# Altium schematic sheet OTHER.SchDoc
size A4
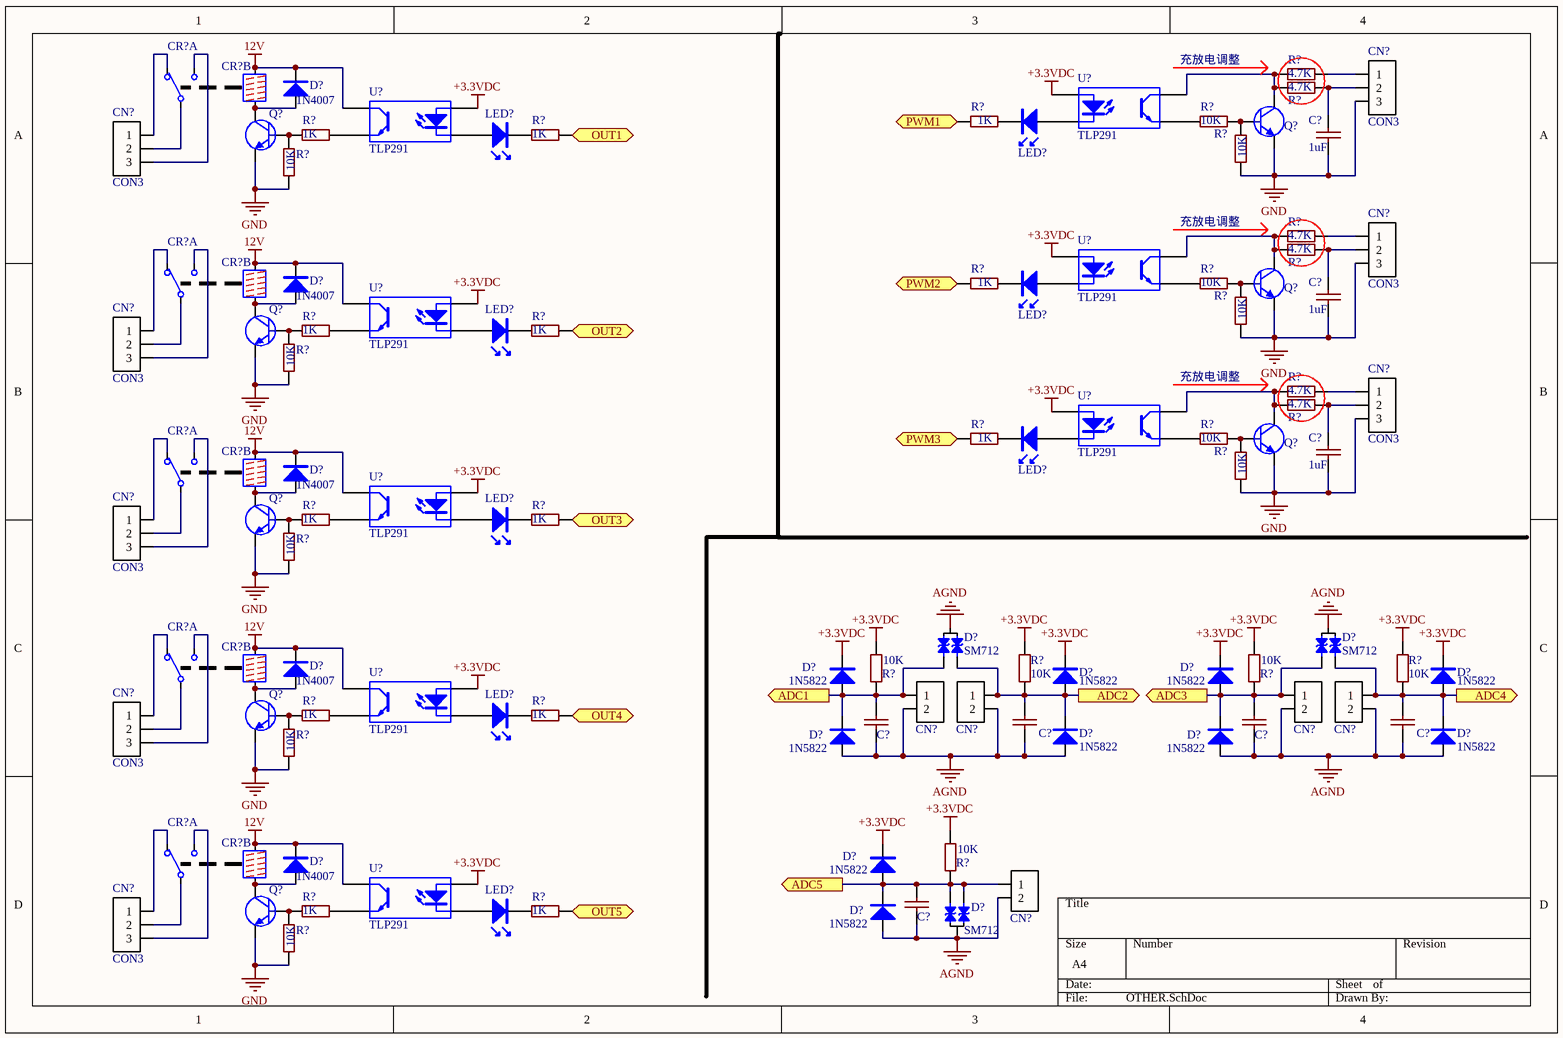
[diagram p0: OTHER.SchDoc]

## Parts
(Parts that share a designator on the sheet are numbered #1, #2 ... from top to bottom, then left to right.)
C?#1  1uF  [0603_C]
C?#2  1uF  [0603_C]
C?#3  1uF  [0603_C]
C?#4  CAP  [0603_C]  (value not drawn)
C?#5  CAP  [0603_C]  (value not drawn)
C?#6  CAP  [0603_C]  (value not drawn)
C?#7  CAP  [0603_C]  (value not drawn)
C?#8  CAP  [0603_C]  (value not drawn)
CN?#1  CON3  [WJ128V-3P]
CN?#2  CON3  [WJ128V-3P]
CN?#3  CON3  [WJ128V-3P]
CN?#4  CON3  [WJ128V-3P]
CN?#5  CON3  [WJ128V-3P]
CN?#6  CON3  [WJ128V-3P]
CN?#7  CON2  [HB9500-2P]  (value not drawn)
CN?#8  CON2  [HB9500-2P]  (value not drawn)
CN?#9  CON2  [HB9500-2P]  (value not drawn)
CN?#10  CON2  [HB9500-2P]  (value not drawn)
CN?#11  CON3  [WJ128V-3P]
CN?#12  CON2  [HB9500-2P]  (value not drawn)
CN?#13  CON3  [WJ128V-3P]
CR?#1  继电器  [G5Q-14]  (value not drawn)  (part A of 2)
CR?#2  继电器  [G5Q-14]  (value not drawn)  (part B of 2)
CR?#3  继电器  [G5Q-14]  (value not drawn)  (part A of 2)
CR?#4  继电器  [G5Q-14]  (value not drawn)  (part B of 2)
CR?#5  继电器  [G5Q-14]  (value not drawn)  (part A of 2)
CR?#6  继电器  [G5Q-14]  (value not drawn)  (part B of 2)
CR?#7  继电器  [G5Q-14]  (value not drawn)  (part A of 2)
CR?#8  继电器  [G5Q-14]  (value not drawn)  (part B of 2)
CR?#9  继电器  [G5Q-14]  (value not drawn)  (part A of 2)
CR?#10  继电器  [G5Q-14]  (value not drawn)  (part B of 2)
D?#1  1N4007  [MUR]
D?#2  1N4007  [MUR]
D?#3  1N4007  [MUR]
D?#4  SM712  [SOT-23]
D?#5  SM712  [SOT-23]
D?#6  1N4007  [MUR]
D?#7  1N5822  [MUR]
D?#8  1N5822  [MUR]
D?#9  1N5822  [MUR]
D?#10  1N5822  [MUR]
D?#11  1N5822  [MUR]
D?#12  1N5822  [MUR]
D?#13  1N5822  [MUR]
D?#14  1N5822  [MUR]
D?#15  1N4007  [MUR]
D?#16  1N5822  [MUR]
D?#17  SM712  [SOT-23]
D?#18  1N5822  [MUR]
LED?#1  Led  [0603_LED]  (value not drawn)
LED?#2  Led  [0603_LED]  (value not drawn)
LED?#3  Led  [0603_LED]  (value not drawn)
LED?#4  Led  [0603_LED]  (value not drawn)
LED?#5  Led  [0603_LED]  (value not drawn)
LED?#6  Led  [0603_LED]  (value not drawn)
LED?#7  Led  [0603_LED]  (value not drawn)
LED?#8  Led  [0603_LED]  (value not drawn)
Q?#1  1318  [SOT-23]  (value not drawn)
Q?#2  9013  [SOT-23]  (value not drawn)
Q?#3  1318  [SOT-23]  (value not drawn)
Q?#4  9013  [SOT-23]  (value not drawn)
Q?#5  1318  [SOT-23]  (value not drawn)
Q?#6  9013  [SOT-23]  (value not drawn)
Q?#7  9013  [SOT-23]  (value not drawn)
Q?#8  9013  [SOT-23]  (value not drawn)
R?#1  4.7K  [0603_R]
R?#2  4.7K  [0603_R]
R?#3  1K  [0603_R]
R?#4  10K  [0603_R]
R?#5  1K  [0603_R]
R?#6  1K  [0603_R]
R?#7  10K  [0603_R]
R?#8  10K  [0603_R]
R?#9  4.7K  [0603_R]
R?#10  4.7K  [0603_R]
R?#11  1K  [0603_R]
R?#12  10K  [0603_R]
R?#13  10K  [0603_R]
R?#14  1K  [0603_R]
R?#15  1K  [0603_R]
R?#16  10K  [0603_R]
R?#17  4.7K  [0603_R]
R?#18  4.7K  [0603_R]
R?#19  1K  [0603_R]
R?#20  10K  [0603_R]
R?#21  10K  [0603_R]
R?#22  1K  [0603_R]
R?#23  1K  [0603_R]
R?#24  10K  [0603_R]
R?#25  10K  [0603_R]
R?#26  10K  [0603_R]
R?#27  10K  [0603_R]
R?#28  10K  [0603_R]
R?#29  1K  [0603_R]
R?#30  1K  [0603_R]
R?#31  10K  [0603_R]
R?#32  10K  [0603_R]
R?#33  1K  [0603_R]
R?#34  1K  [0603_R]
R?#35  10K  [0603_R]
U?#1  TLP291  [sop-4]
U?#2  TLP291  [sop-4]
U?#3  TLP291  [sop-4]
U?#4  TLP291  [sop-4]
U?#5  TLP291  [sop-4]
U?#6  TLP291  [sop-4]
U?#7  TLP291  [sop-4]
U?#8  TLP291  [sop-4]

## Ports
ADC1 (out), ADC2 (out), ADC3 (out), ADC4 (out), ADC5 (out), OUT1 (in), OUT2 (in), OUT3 (in), OUT4 (in), OUT5 (in), PWM1 (in), PWM2 (in), PWM3 (in)

## Nets
12V: CR?#2.5 CR?#4.5 CR?#6.5 CR?#8.5 CR?#10.5 D?#1.K D?#2.K D?#3.K D?#6.K D?#15.K U?#2.4 U?#4.4 U?#6.4 U?#7.4 U?#8.4
+3.3VDC: D?#7.K D?#8.K D?#9.K D?#10.K D?#16.K R?#25.2 R?#26.2 R?#27.2 R?#28.2 R?#32.2 U?#1.1 U?#2.1 U?#3.1 U?#4.1 U?#5.1 U?#6.1 U?#7.1 U?#8.1
AGND: C?#4.2 C?#5.2 C?#6.2 C?#7.2 C?#8.2 CN?#7.2 CN?#8.2 CN?#9.2 CN?#10.2 CN?#12.2 D?#11.A D?#12.A D?#13.A D?#14.A D?#17.3 D?#18.A
GND: C?#1.2 C?#2.2 C?#3.2 CN?#1.3 CN?#3.3 CN?#5.3 Q?#1.2(E) Q?#2.2(E) Q?#3.2(E) Q?#4.2(E) Q?#5.2(E) Q?#6.2(E) Q?#7.2(E) Q?#8.2(E) R?#7.1 R?#8.1 R?#13.1 R?#16.1 R?#21.1 R?#24.1 R?#31.1 R?#35.1
ADC1: C?#4.1 CN?#7.1 D?#4.2 D?#7.A D?#11.K R?#25.1 ; port ADC1
ADC2: C?#5.1 CN?#8.1 D?#4.1 D?#8.A D?#12.K R?#26.1 ; port ADC2
ADC3: C?#6.1 CN?#9.1 D?#5.2 D?#9.A D?#13.K R?#27.1 ; port ADC3
ADC4: C?#7.1 CN?#10.1 D?#5.1 D?#10.A D?#14.K R?#28.1 ; port ADC4
ADC5: C?#8.1 CN?#12.1 D?#16.A D?#17.1 D?#17.2 D?#18.K R?#32.1 ; port ADC5
OUT1: R?#6.2 ; port OUT1
OUT2: R?#15.2 ; port OUT2
OUT3: R?#23.2 ; port OUT3
OUT4: R?#30.2 ; port OUT4
OUT5: R?#34.2 ; port OUT5
PWM1: R?#3.2 ; port PWM1
PWM2: R?#11.2 ; port PWM2
PWM3: R?#19.2 ; port PWM3
NetC?#1_1: C?#1.1 CN?#1.2 R?#2.2
NetC?#2_1: C?#2.1 CN?#3.2 R?#10.2
NetC?#3_1: C?#3.1 CN?#5.2 R?#18.2
NetCN?#1_1: CN?#1.1 R?#1.2
NetCN?#2_1: CN?#2.1 CR?#1.2
NetCN?#2_2: CN?#2.2 CR?#1.4
NetCN?#2_3: CN?#2.3 CR?#1.3
NetCN?#3_1: CN?#3.1 R?#9.2
NetCN?#4_1: CN?#4.1 CR?#3.2
NetCN?#4_2: CN?#4.2 CR?#3.4
NetCN?#4_3: CN?#4.3 CR?#3.3
NetCN?#5_1: CN?#5.1 R?#17.2
NetCN?#6_1: CN?#6.1 CR?#5.2
NetCN?#6_2: CN?#6.2 CR?#5.4
NetCN?#6_3: CN?#6.3 CR?#5.3
NetCN?#11_1: CN?#11.1 CR?#7.2
NetCN?#11_2: CN?#11.2 CR?#7.4
NetCN?#11_3: CN?#11.3 CR?#7.3
NetCN?#13_1: CN?#13.1 CR?#9.2
NetCN?#13_2: CN?#13.2 CR?#9.4
NetCN?#13_3: CN?#13.3 CR?#9.3
NetCR?#2_1: CR?#2.1 D?#1.A Q?#2.3(C)
NetCR?#4_1: CR?#4.1 D?#2.A Q?#4.3(C)
NetCR?#6_1: CR?#6.1 D?#3.A Q?#6.3(C)
NetCR?#8_1: CR?#8.1 D?#6.A Q?#7.3(C)
NetCR?#10_1: CR?#10.1 D?#15.A Q?#8.3(C)
NetLED?#1_A: LED?#1.A U?#1.2
NetLED?#1_K: LED?#1.K R?#3.1
NetLED?#2_A: LED?#2.A U?#2.2
NetLED?#2_K: LED?#2.K R?#6.1
NetLED?#3_A: LED?#3.A U?#3.2
NetLED?#3_K: LED?#3.K R?#11.1
NetLED?#4_A: LED?#4.A U?#4.2
NetLED?#4_K: LED?#4.K R?#15.1
NetLED?#5_A: LED?#5.A U?#5.2
NetLED?#5_K: LED?#5.K R?#19.1
NetLED?#6_A: LED?#6.A U?#6.2
NetLED?#6_K: LED?#6.K R?#23.1
NetLED?#7_A: LED?#7.A U?#7.2
NetLED?#7_K: LED?#7.K R?#30.1
NetLED?#8_A: LED?#8.A U?#8.2
NetLED?#8_K: LED?#8.K R?#34.1
NetQ?#1_1: Q?#1.1(B) R?#4.2 R?#7.2
NetQ?#1_3: Q?#1.3(C) R?#1.1 R?#2.1 U?#1.4
NetQ?#2_1: Q?#2.1(B) R?#5.2 R?#8.2
NetQ?#3_1: Q?#3.1(B) R?#12.2 R?#13.2
NetQ?#3_3: Q?#3.3(C) R?#9.1 R?#10.1 U?#3.4
NetQ?#4_1: Q?#4.1(B) R?#14.2 R?#16.2
NetQ?#5_1: Q?#5.1(B) R?#20.2 R?#21.2
NetQ?#5_3: Q?#5.3(C) R?#17.1 R?#18.1 U?#5.4
NetQ?#6_1: Q?#6.1(B) R?#22.2 R?#24.2
NetQ?#7_1: Q?#7.1(B) R?#29.2 R?#31.2
NetQ?#8_1: Q?#8.1(B) R?#33.2 R?#35.2
NetR?#4_1: R?#4.1 U?#1.3
NetR?#5_1: R?#5.1 U?#2.3
NetR?#12_1: R?#12.1 U?#3.3
NetR?#14_1: R?#14.1 U?#4.3
NetR?#20_1: R?#20.1 U?#5.3
NetR?#22_1: R?#22.1 U?#6.3
NetR?#29_1: R?#29.1 U?#7.3
NetR?#33_1: R?#33.1 U?#8.3

Not connected (* = marked no-connect by the designer): D?#4 3; D?#5 3

## Notes on the sheet
- 充放电调整
- Labels drawn without touching a wire or pin: AGND

## Library data of the parts
C?#1-C?#8 = CAP: 电容; 风华: 0603CG200J500NT; 三星: CL10C200JB8NNNC; 三星: CL10B104JB8NNNC; 风华: 0603B104J500NT
CN?#1-CN?#6 CN?#11 CN?#13 = CON3: 连接器
CN?#7-CN?#10 CN?#12 = CON2: 连接器; KANGNEX(康奈克斯电气): HB9500-2P 黑色
D?#1-D?#3 D?#6-D?#16 D?#18 = DIODE: 二极管
D?#4 D?#5 D?#17 = TVS: 台湾元基: SM712
LED?#1-LED?#8 = Led: 发光二极管
Q?#1-Q?#8 = NPN: 三极管
R?#1-R?#35 = RES: 电阻
CR?#1-CR?#10 = 继电器: Published: 24-Mar-1999; LatestRevisionDate: 17-Jul-2002; LatestRevisionNote: Re-released for DXP Platform.; PackageReference: DIP-P8; Publisher: Altium Limited